# EasyEDA Pro project RealisticPM_2026-10-08.epro, board segment_1
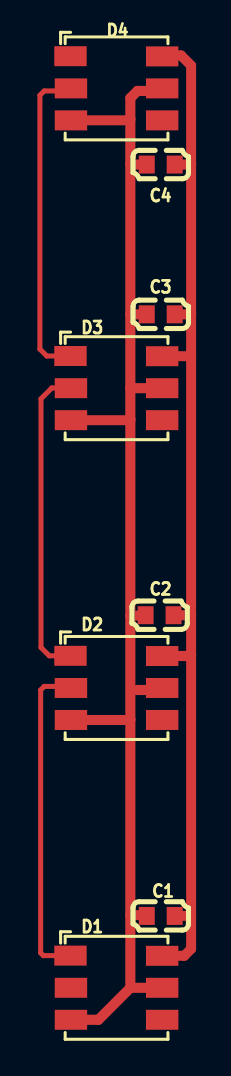
[diagram p8: board, top side]
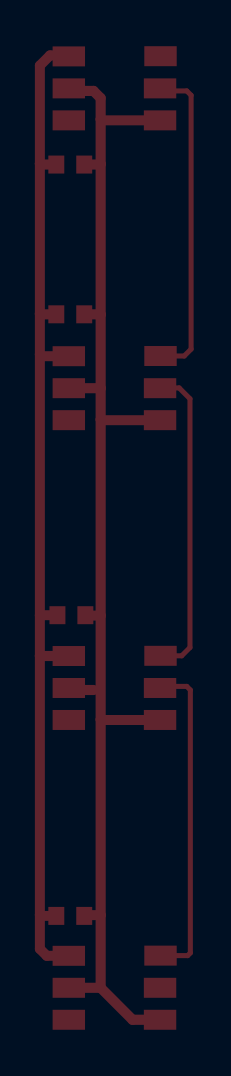
[diagram p9: board, bottom side, seen from below]

No outline. copper layers: Top Layer, Bottom Layer. Coordinates in mm from the lowest, leftmost part position.
Stack: Top Layer 0.035mm / Dielectric1 1.51mm FR4 er 4.5 / Bottom Layer 0.035mm

## Design rules (mm)
spacing copperThickness1oz (default): track to track 0.102, other pairs 0.152 to 0.3
spacing copperThickness2oz: track to track 0.203, other pairs 0.152 to 0.3
spacing Plane_innerPlane: track to track 0.102, other pairs 0.152 to 0.3
spacing Copper_copperRegion: track to track 0.102, other pairs 0.152 to 0.3
track width copperThickness1oz (default): min 0.127, default 0.254, max 2.54
track width copperThickness2oz: min 0.203, default 0.254, max 2.54
differential pair differentialPair (default): width min 0.127, default 0.254, max 2.54; gap min 0.152, default 0.152

## Placement (name value [footprint] x y rotation side)
C1  100nF  [C0603]  2.22 3.6 0 top
C2  100nF  [C0603]  2.16 18.64 0 top
C3  100nF  [C0603]  2.22 33.7 0 top
C4  100nF  [C0603]  2.22 41.19 0 top
D1  IN-PI55TBTPRPGPB  [LED-SMD_6P-L5.0-W5.0-P1.60-LS5.4_A-SC5050ARGBC-B01-03-1T]  0 0 0 top
D2  IN-PI55TBTPRPGPB  [LED-SMD_6P-L5.0-W5.0-P1.60-LS5.4_A-SC5050ARGBC-B01-03-1T]  0 15 0 top
D3  IN-PI55TBTPRPGPB  [LED-SMD_6P-L5.0-W5.0-P1.60-LS5.4_A-SC5050ARGBC-B01-03-1T]  0 30 0 top
D4  IN-PI55TBTPRPGPB  [LED-SMD_6P-L5.0-W5.0-P1.60-LS5.4_A-SC5050ARGBC-B01-03-1T]  0 45 0 top

## Footprints (pads in the part's own frame, mm; a bottom-side part is the same pattern mirrored in y, then rotated)
C0603
  rect 0.8x0.9 smd: 1(-0.7,0) 2(0.7,0)
LED-SMD_6P-L5.0-W5.0-P1.60-LS5.4_A-SC5050ARGBC-B01-03-1T
  rect 1.625x1 smd: 1(-2.31,1.61) 2(-2.288,0) 3(-2.288,-1.6) 4(2.288,-1.6) 5(2.288,0) 6(2.288,1.6)

## Nets
GND: C1.2 C2.2 C3.2 C4.2 D1.6 D2.6 D3.6 D4.6
VCC: C1.1 C2.1 C3.1 C4.1 D1.3 D1.5 D2.3 D2.5 D3.3 D3.5 D4.3 D4.5
DI: D1.2
DO: D4.1
$1N1294: D3.1 D4.2
$1N1306: D2.1 D3.2
$1N1312: D1.1 D2.2

Pads without a net: D1 4; D2 4; D3 4; D4 4

## Routing (per net, layer and track width the routed paths; a pad name or vN(x,y) marks a point on that pad's centre or on a via; arc(x,y) is an arc through that point)
GND: length 53.8
  Top Layer w0.5: 3.74,18.64 3.73,18.64 C2.2 ; 3.74,18.64 3.74,31.69 ; 3.74,18.64 3.74,3.65 ; 3.74,31.69 3.64,31.6 D3.6 ; 3.74,31.69 3.74,46.14 3.23,46.65 2.34,46.65 D4.6 ; C1.2 3.69,3.6 3.74,3.65 ; 3.74,3.65 3.74,1.95 3.39,1.6 D1.6
  Top Layer w0.508: D2.6 3.73,16.6 3.74,16.61 ; 3.74,41.23 3.69,41.19 C4.2 ; 3.74,33.72 3.71,33.7 C3.2
VCC: length 66.7
  Top Layer w0.254: C1.1 1.47,3.64
  Top Layer w0.5: C2.1 1.44,18.62 0.69,18.62 ; D3.3 0.66,28.4 0.69,28.43 ; 1.47,3.64 0.69,3.64 ; D4.3 0.63,43.4 0.69,43.46 ; 0.69,13.42 0.67,13.4 D2.3
  Top Layer w0.508: 0.69,33.69 0.7,33.7 C3.1 ; 0.69,33.69 0.69,41.21 ; 0.69,33.69 0.69,30 ; D4.5 2.16,44.87 1.05,44.87 0.69,44.51 0.69,41.21 ; C4.1 0.72,41.19 0.69,41.21 ; 1.05,14.9 2.19,14.9 D2.5 ; 0.69,0 -0.91,-1.6 D1.3 ; 0.69,0 0.69,30 ; 0.69,0 D1.5 ; 0.69,30 D3.5
$1N1294: length 16.1
  Top Layer w0.254: D4.2 -2.42,44.87 -3.63,44.87 -3.84,44.65 -3.84,31.95 -3.5,31.61 D3.1
$1N1306: length 15.8
  Top Layer w0.254: D3.2 -2.3,30.01 -3.25,30.01 -3.79,29.47 -3.79,17.02 -3.37,16.61 D2.1
$1N1312: length 16.3
  Top Layer w0.254: D2.2 -2.37,15.08 -3.63,15.08 -3.81,14.9 -3.81,1.74 -3.67,1.61 D1.1
